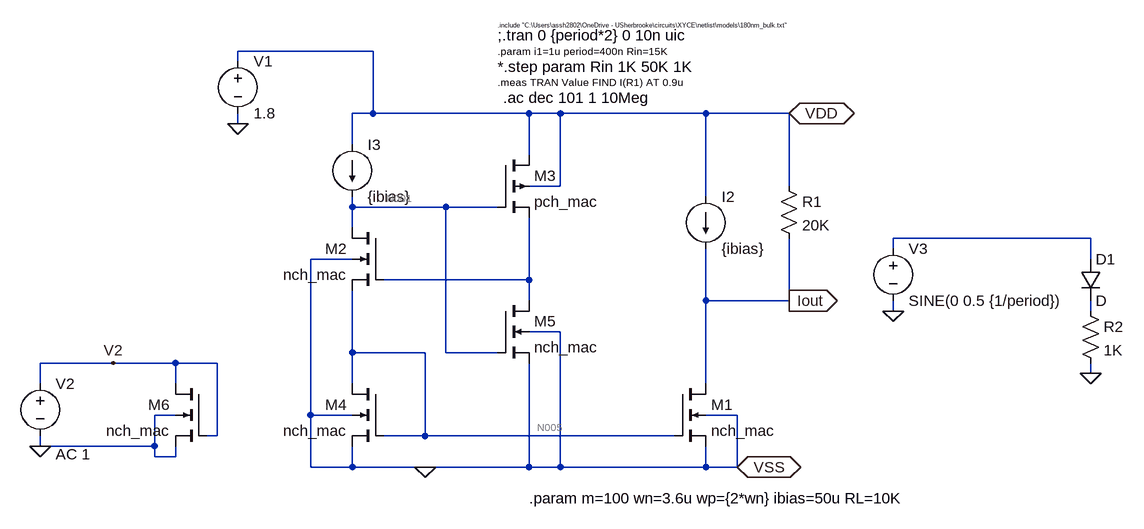
[diagram p0: schematic Test_CM_v1.asc]
Test_CM_v1.asc, the LTspice schematic file:
Version 4
SHEET 1 1332 936
WIRE 112 224 -96 224
WIRE -96 240 -96 224
WIRE 112 320 112 224
WIRE 112 320 80 320
WIRE 352 320 112 320
WIRE 400 320 352 320
WIRE 624 320 400 320
WIRE 752 320 624 320
WIRE -96 336 -96 320
WIRE 80 368 80 320
WIRE 352 384 352 320
WIRE 400 432 400 320
WIRE 400 432 352 432
WIRE 752 432 752 320
WIRE 624 448 624 320
WIRE 80 464 80 448
WIRE 224 464 80 464
WIRE 304 464 224 464
WIRE 80 496 80 464
WIRE 1216 512 912 512
WIRE 912 528 912 512
WIRE 80 544 16 544
WIRE 1216 544 1216 512
WIRE 352 576 352 480
WIRE 352 576 128 576
WIRE 352 608 352 576
WIRE 624 608 624 528
WIRE 752 608 752 512
WIRE 752 608 624 608
WIRE 912 624 912 608
WIRE 1216 624 1216 608
WIRE 400 656 352 656
WIRE 80 688 80 592
WIRE 192 688 80 688
WIRE 224 688 224 464
WIRE 304 688 224 688
WIRE -288 704 -400 704
WIRE -192 704 -288 704
WIRE -128 704 -192 704
WIRE 1216 720 1216 704
WIRE -400 736 -400 704
WIRE -192 736 -192 704
WIRE 80 736 80 688
WIRE 624 736 624 608
WIRE -192 784 -224 784
WIRE 16 784 16 544
WIRE 80 784 16 784
WIRE 672 784 624 784
WIRE -128 816 -128 704
WIRE -128 816 -144 816
WIRE 192 816 192 688
WIRE 192 816 128 816
WIRE 576 816 192 816
WIRE -400 832 -400 816
WIRE -224 832 -224 784
WIRE -224 832 -400 832
WIRE -224 848 -224 832
WIRE -192 848 -192 832
WIRE -192 848 -224 848
WIRE 16 864 16 784
WIRE 80 864 80 832
WIRE 80 864 16 864
WIRE 192 864 80 864
WIRE 352 864 352 704
WIRE 352 864 192 864
WIRE 400 864 400 656
WIRE 400 864 352 864
WIRE 624 864 624 832
WIRE 624 864 400 864
WIRE 672 864 672 784
WIRE 672 864 624 864
FLAG -96 336 0
FLAG 752 320 VDD
IOPIN 752 320 BiDir
FLAG 672 864 VSS
IOPIN 672 864 BiDir
FLAG 752 608 Iout
IOPIN 752 608 Out
FLAG 192 864 0
FLAG -400 832 0
FLAG -288 704 V2
FLAG 1216 720 0
FLAG 912 624 0
SYMBOL voltage -96 224 R0
WINDOW 123 0 0 Left 0
WINDOW 39 0 0 Left 0
SYMATTR InstName V1
SYMATTR Value 1.8
SYMBOL res 736 416 R0
SYMATTR InstName R1
SYMATTR Value 20K
SYMBOL nmos4 576 736 R0
SYMATTR InstName M1
SYMATTR Value nch_mac
SYMATTR Value2 l=0.18u w=3.6u m={m}
SYMBOL pmos4 304 384 R0
SYMATTR InstName M3
SYMATTR Value pch_mac
SYMATTR Value2 l=180n w=10.8u m={m}
SYMBOL nmos4 128 736 M0
SYMATTR InstName M4
SYMATTR Value nch_mac
SYMATTR Value2 l=0.18u w=10u m=100
SYMBOL current 624 448 R0
WINDOW 123 0 0 Left 0
WINDOW 39 0 0 Left 0
SYMATTR InstName I2
SYMATTR Value {ibias}
SYMBOL current 80 368 R0
WINDOW 123 0 0 Left 0
WINDOW 39 0 0 Left 0
SYMATTR InstName I3
SYMATTR Value {ibias}
SYMBOL nmos4 304 608 R0
SYMATTR InstName M5
SYMATTR Value nch_mac
SYMATTR Value2 l=0.18u w=0.36u m={m}
SYMBOL voltage -400 720 R0
WINDOW 123 24 124 Left 2
WINDOW 39 0 0 Left 0
SYMATTR Value2 AC 1
SYMATTR InstName V2
SYMATTR Value ""
SYMBOL nmos4 128 496 M0
SYMATTR InstName M2
SYMATTR Value nch_mac
SYMATTR Value2 l=0.18u w=10u m=100
SYMBOL diode 1200 544 R0
SYMATTR InstName D1
SYMBOL res 1200 608 R0
SYMATTR InstName R2
SYMATTR Value 1K
SYMBOL voltage 912 512 R0
WINDOW 123 0 0 Left 0
WINDOW 39 0 0 Left 0
SYMATTR InstName V3
SYMATTR Value SINE(0 0.5 {1/period})
SYMBOL nmos4 -144 736 M0
SYMATTR InstName M6
SYMATTR Value nch_mac
SYMATTR Value2 l=0.18u w=36u m=1000
TEXT 304 200 Left 2 !;.tran 0 {period*2} 0 10n uic
TEXT 304 224 Left 1 !.param i1=1u period=400n Rin=15K
TEXT 304 184 Left 0 !.include "C:\\Users\\assh2802\\OneDrive - USherbrooke\\circuits\\XYCE\\netlist\\models\\180nm_bulk.txt"
TEXT 304 248 Left 2 !*.step param Rin 1K 50K 1K
TEXT 304 272 Left 1 !.meas TRAN Value FIND I(R1) AT 0.9u
TEXT 352 912 Left 2 !.param m=100 wn=3.6u wp={2*wn} ibias=50u RL=10K
TEXT 312 296 Left 2 !.ac dec 101 1 10Meg

The netlist it stands for:
* Test_CM_v1.asc
V1 VDD 0 1.8
R1 VDD Iout 20K
M1 Iout N005 0 0 nch_mac l=0.18u w=3.6u m={m}
M3 VDD N001 N003 VDD pch_mac l=180n w=10.8u m={m}
M4 N005 N005 0 0 nch_mac l=0.18u w=10u m=100
I2 VDD Iout {ibias}
I3 VDD N001 {ibias}
M5 N003 N001 0 0 nch_mac l=0.18u w=0.36u m={m}
V2 V2 0 AC 1
M2 N001 N003 N005 0 nch_mac l=0.18u w=10u m=100
D1 N002 N004 D
R2 N004 0 1K
V3 N002 0 SINE(0 0.5 {1/period})
M6 V2 V2 0 0 nch_mac l=0.18u w=36u m=1000
.model D D
.lib standard.dio
.model NMOS NMOS
.model PMOS PMOS
.lib standard.mos
;.tran 0 {period*2} 0 10n uic
.param i1=1u period=400n Rin=15K
.include "C:\Users\assh2802\OneDrive - USherbrooke\circuits\XYCE\netlist\models\180nm_bulk.txt"
*.step param Rin 1K 50K 1K
.meas TRAN Value FIND I(R1) AT 0.9u
.param m=100 wn=3.6u wp={2*wn} ibias=50u RL=10K
.ac dec 101 1 10Meg
.backanno
.end

* Results of the author's LTspice run, read from the files saved beside the schematic
* Operating Point, zero values left out:
*   V(vdd) = 1.8 V
*   V(iout) = 1.044 V
*   V(n005) = 242 mV
*   V(n001) = 9.078 V
*   Id(M1) = 87.78 µA
*   Ib(M1) = -105.4 pA
*   Is(M1) = -87.78 µA
*   Id(M4) = 50 µA
*   Ib(M4) = -25.2 pA
*   Is(M4) = -50 µA
*   Id(M5) = 181 pA
*   Is(M5) = -181 pA
*   Id(M2) = 50 µA
*   Ib(M2) = -934 pA
*   Is(M2) = -50 µA
*   Ib(M3) = 181 pA
*   Is(M3) = -181 pA
*   I(I2) = 50 µA
*   I(I3) = 50 µA
*   I(R1) = 37.78 µA
*   I(V1) = -137.8 µA